# EAGLE schematic billReminder (EAGLE 7.3.0)
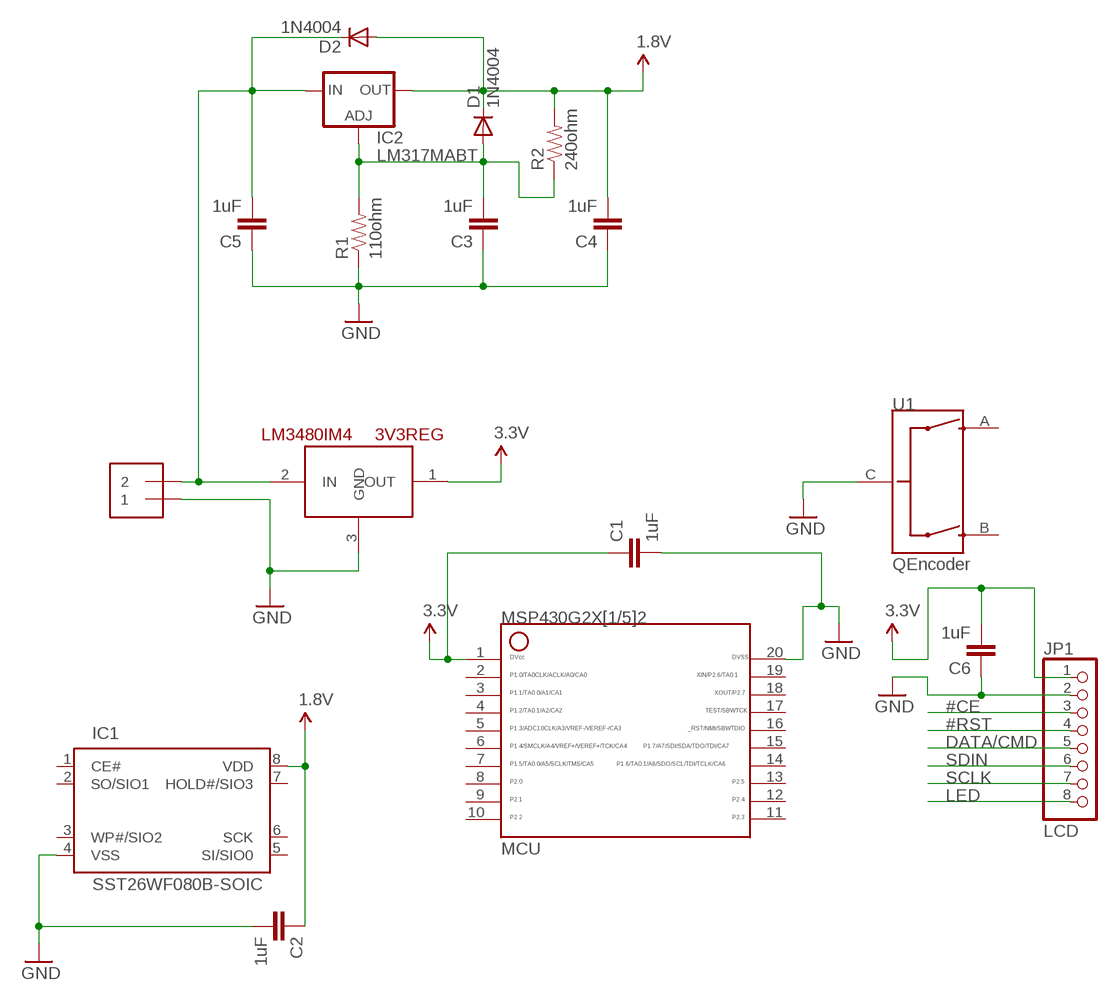
[diagram p0: schematic, sheet 1]

## Parts
3V3REG  LM3480IM4  [SOT23-3]
C1  1uF  CAPPTH  [CAP-PTH-SMALL]
C2  1uF  CAPPTH  [CAP-PTH-SMALL]
C3  1uF  CAPPTH  [CAP-PTH-SMALL]
C4  1uF  CAPPTH  [CAP-PTH-SMALL]
C5  1uF  CAPPTH  [CAP-PTH-SMALL]
C6  1uF  CAPPTH  [CAP-PTH-SMALL]
D1  1N4004  [DO41-10]
D2  1N4004  [DO41-10]
IC1  SST26WF080B-SOIC  [SOIC08]
IC2  LM317MABT  [TO220L1]
J1  1X2-3.5MM  [1X2-3.5MM]
JP1  LCD  PINHD-1X8CLEANBIG  [1X08-CLEANBIG]
MCU  G2X[1/5]2---N20  [DIL20]
R1  110ohm  RESISTORPTH-1/2W  [AXIAL-0.5]
R2  240ohm  RESISTORPTH-1/2W  [AXIAL-0.5]
U1  QEncoder  ENCODER-QUADRATURE  [ENCODER-16MM-QUAD]

## Nets
1.8V [supply]: C2.1 C4.2 D1.C D2.A IC1.8(VDD) IC2.2(OUT) R2.P$2
3.3V [supply]: 3V3REG.1(OUT) C1.1 C6.2 JP1.1 MCU.1(1_DVCC)
#CE: JP1.3
#RST: JP1.4
DATA/CMD: JP1.5
GND [supply]: 3V3REG.3(GND) C1.2 C2.2 C3.1 C4.1 C5.1 C6.1 IC1.4(VSS) J1.1 JP1.2 MCU.20(20_DVSS) R1.P$1 U1.C
LED [supply]: JP1.8
N$1 [supply]: 3V3REG.2(IN) C5.2 D2.C IC2.3(IN) J1.2
N$6 [supply]: C3.2 D1.A IC2.1(ADJ) R1.P$2 R2.P$1
SCLK: JP1.7
SDIN: JP1.6
Unconnected: IC1.1(CE#) IC1.2(SO/SIO1) IC1.3(WP#/SIO2) IC1.6(SCK) IC1.7(HOLD#/SIO3) MCU.2(2_1.0) MCU.3(3_1.1) MCU.4(4_1.2) MCU.5(5_1.3) MCU.6(6_1.4) MCU.7(7_1.5) MCU.8(8_2.0) MCU.9(9_2.1) MCU.10(10_2.2) MCU.11(11_2.3) MCU.12(12_2.4) MCU.13(13_2.5) MCU.14(14_1.6) MCU.15(15_1.7) MCU.16(16_RST) MCU.17(17_TEST) MCU.18(18_XOUT) MCU.19(19_XIN) U1.A U1.B

## Power pins joined to a net without a drawn wire
SI/SIO0: IC1.5(SI/SIO0)

## Library data of the parts
3V3REG = SparkFun-PowerIC:LM3480IM4: Small package linear regulator
C1-C6 = SparkFun-Capacitors:CAP: Capacitor Standard 0603 ceramic capacitor, and 0.1" leaded capacitor.
D1 D2 = adafruit:1N4004: DIODE General purpose 1N400x type rectifier (With bigger pads) http://www.ladyada.net/library/pcb/eaglelibrary.html
IC1 = max parts:SST26WF080B: Flash Memory; OC_FARNELL: unknown; OC_NEWARK: unknown
IC2 = v-reg:LM317?*: 500 mA Adjustable Output Positive Voltage Regulator Source: http://www.onsemi.co.jp .. LM317M-D.PDF
J1 = adafruit:1X2: 3.5mm Terminal block http://www.ladyada.net/library/pcb/eaglelibrary.html
JP1 = adafruit:PINHD-1X8: PIN HEADER
MCU = TI_MSP430_v16:G2X[1/5]2---N20: MSP430G2X[1/5]2 MSP430G2x52, MSP430G2x12 PDIP (N) 20 Pin Package http://focus.ti.com/docs/prod/folders/print/msp430g2452.html
R1 R2 = SparkFun-Passives:RESISTOR: Resistor Basic schematic elements and footprints for 0603, 1206, and PTH resistors.
U1 = SparkFun-Electromechanical:ENCODER-QUADRATURE: quadrature encoder from Top-Up, part#EC16PHBF-B-20F-24-24C-16Y

## Net classes
0 default: width 0.254 mm, clearance 0.254 mm
1 supply: width 0.508 mm, clearance 0.508 mm